# EAGLE design ReflowController_true_rev2 (EAGLE 6.5.0)
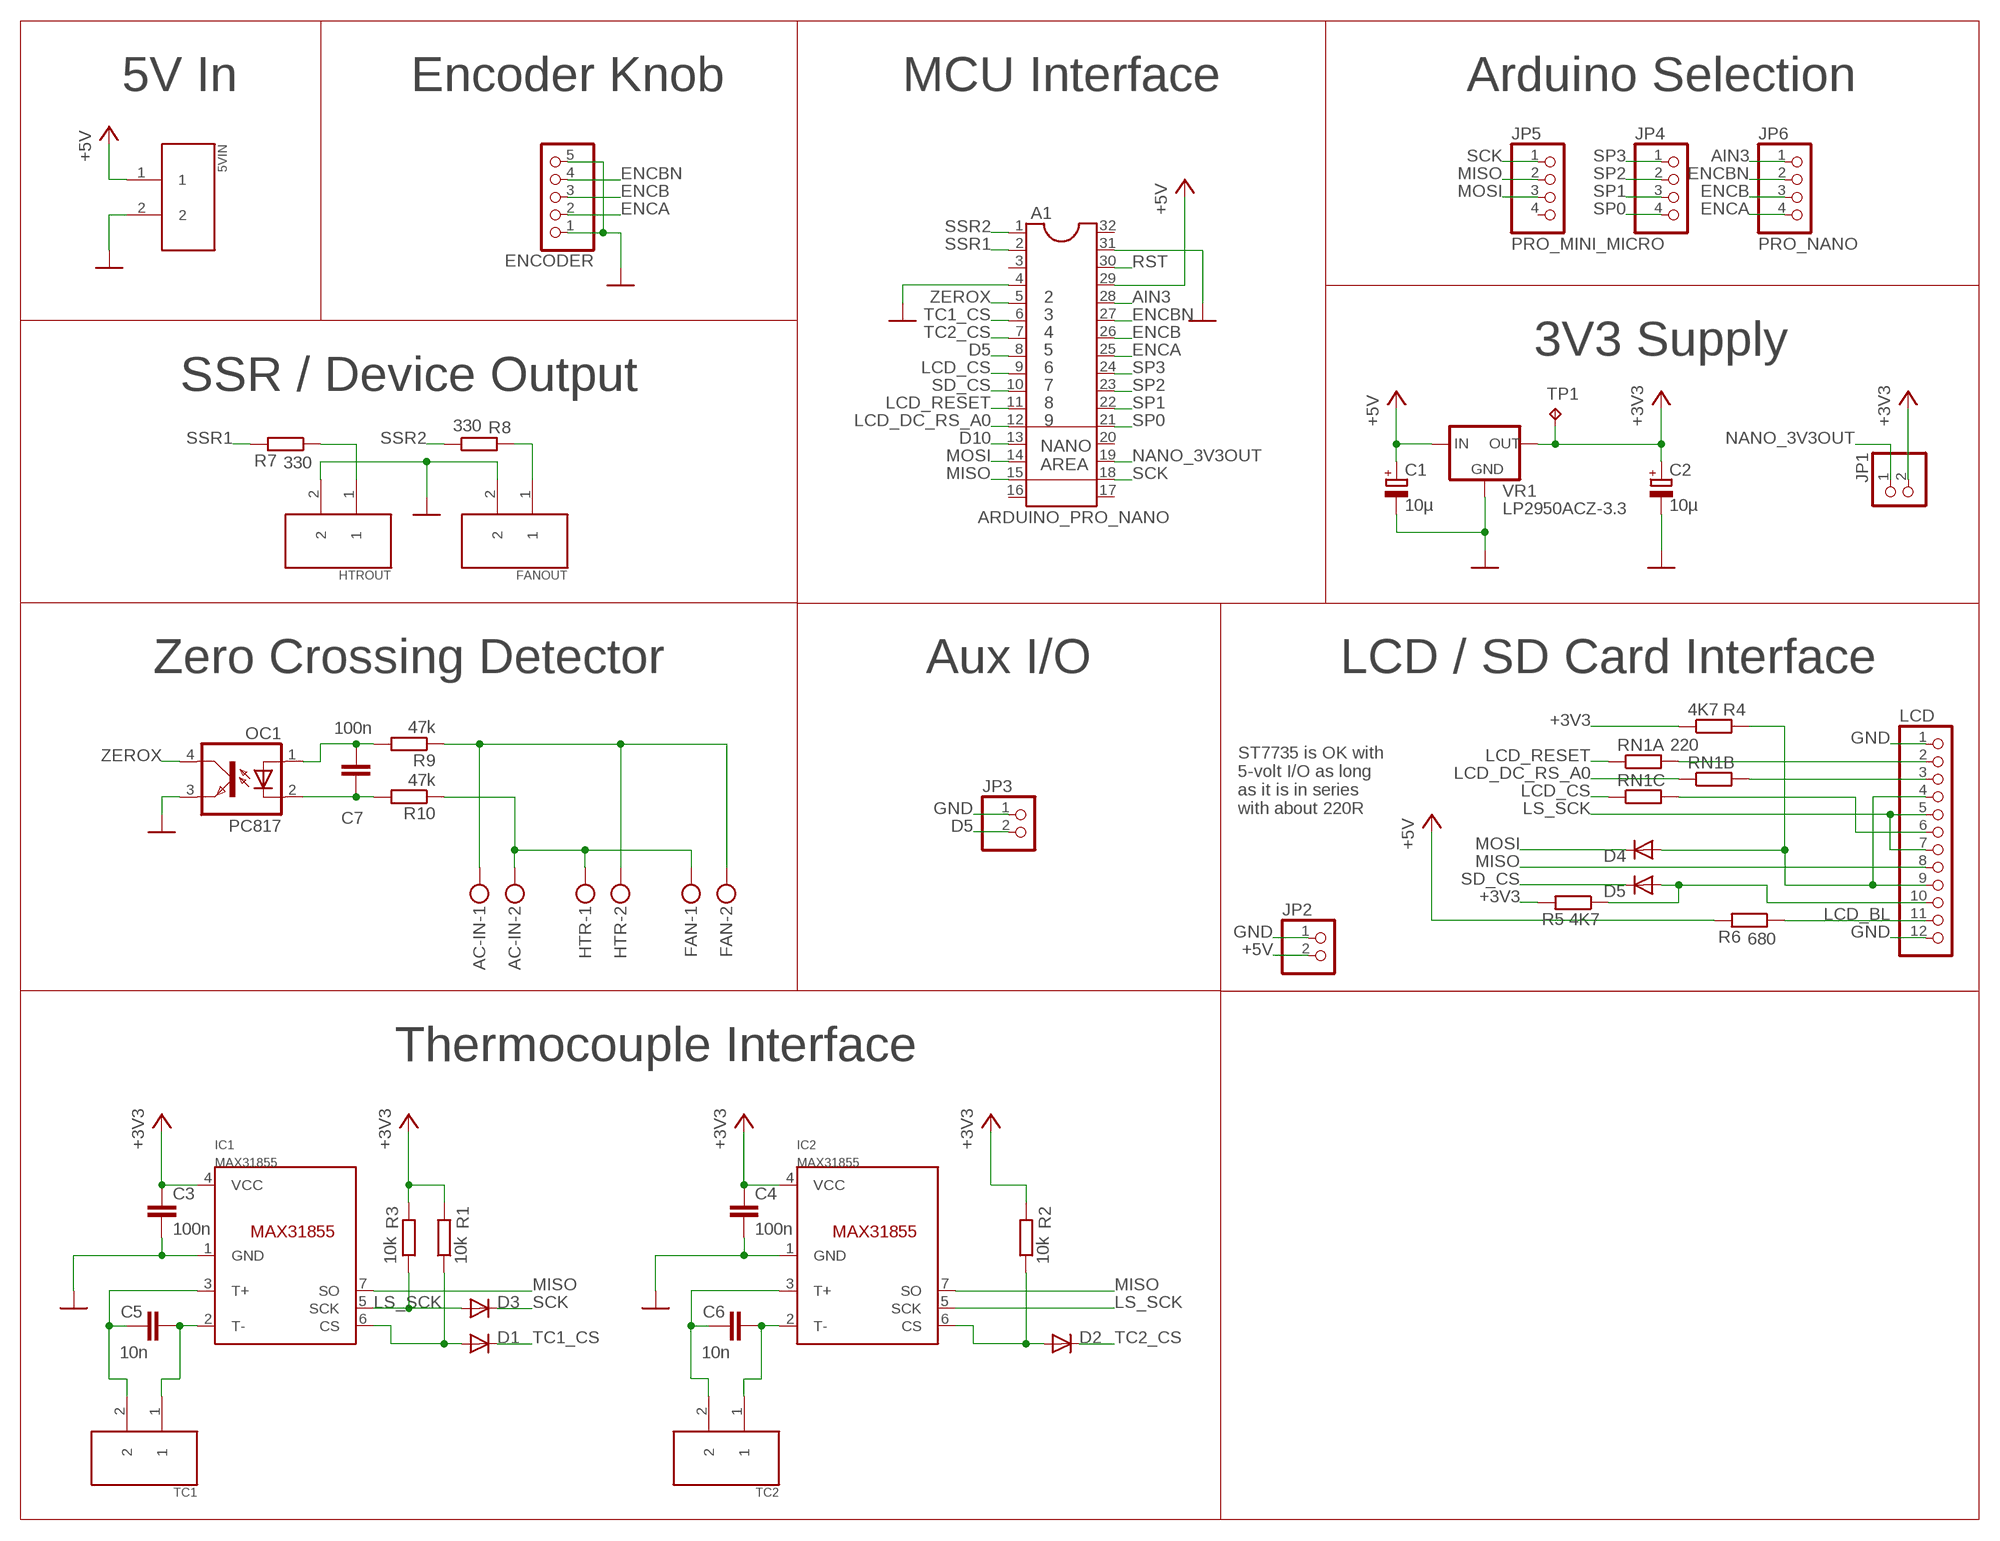
[diagram p0: schematic, sheet 1]

## Parts
5VIN  WECO_110-M-221/2  [WECO-PHOENIXTERM-2-POS]
A1  ARDUINO_PRO_NANO  DIL32  [DIL32]
AC-IN  MKDSN1,5/2-5,08  [MKDSN1,5/2-5,08]
C1  10µ  CPOL-EUC/6032-28R  [C/6032-28R]
C2  10µ  CPOL-EUC/6032-28R  [C/6032-28R]
C3  100n  C-EUC0805  [C0805]
C4  100n  C-EUC0805  [C0805]
C5  10n  C-EUC0805  [C0805]
C6  10n  C-EUC0805  [C0805]
C7  100n  C-EU150-054X183  [C150-054X183]
D1  DIODESOD-123  [SOD-123]
D2  DIODESOD-123  [SOD-123]
D3  DIODESOD-123  [SOD-123]
D4  DIODESOD-123  [SOD-123]
D5  DIODESOD-123  [SOD-123]
ENCODER  PINHD-1X5  [1X05]
FAN  MKDSN1,5/2-5,08  [MKDSN1,5/2-5,08]
FANOUT  WECO_110-M-221/2  [WECO-PHOENIXTERM-2-POS]
HTR  MKDSN1,5/2-5,08  [MKDSN1,5/2-5,08]
HTROUT  WECO_110-M-221/2  [WECO-PHOENIXTERM-2-POS]
IC1  MAX31855  [SOIC8]
IC2  MAX31855  [SOIC8]
JP1  PINHD-1X2  [1X02]
JP2  PINHD-1X2  [1X02]
JP3  PINHD-1X2  [1X02]
JP4  PINHD-1X4RND  [1X04_RND]
JP5  PRO_MINI_MICRO  PINHD-1X4RND  [1X04_RND]
JP6  PRO_NANO  PINHD-1X4RND  [1X04_RND]
LCD  PINHD-1X12  [1X12]
OC1  PC817  [DIL04]
R1  10k  R-EU_R0805  [R0805]
R2  10k  R-EU_R0805  [R0805]
R3  10k  R-EU_R0805  [R0805]
R4  4K7  R-EU_R0805  [R0805]
R5  4K7  R-EU_R0805  [R0805]
R6  680  R-EU_R0805  [R0805]
R7  330  R-EU_R0805  [R0805]
R8  330  R-EU_R0805  [R0805]
R9  47k  R-EU_0207/5V  [0207/5V]
R10  47k  R-EU_0207/5V  [0207/5V]
RN1  220  RESISTOR_ARRAY_4  [RN8P-4R-CRA06S]
TC1  WECO_110-M-221/2  [WECO-PHOENIXTERM-2-POS]
TC2  WECO_110-M-221/2  [WECO-PHOENIXTERM-2-POS]
TP1  TPTP08R  [TP08R]
VR1  LP2950ACZ-3.3  [TO92]

## Nets
+3V3: C2.+ C3.1 C4.1 IC1.4(VCC) IC2.4(VCC) JP1.2 R1.2 R2.2 R3.2 R4.1 R5.2 TP1.TP VR1.1(OUT)
+5V: 5VIN.1 A1.29 C1.+ JP2.2 R6.2 VR1.3(IN)
AC1: AC-IN.1 FAN.2 HTR.2 R9.1
AC2: AC-IN.2 FAN.1 HTR.1 R10.1
AIN3: A1.28 JP6.1
D5: A1.8 JP3.2
D10: A1.13
ENCA: A1.25 ENCODER.2 JP6.4
ENCB: A1.26 ENCODER.3 JP6.3
ENCBN: A1.27 ENCODER.4 JP6.2
GND: 5VIN.2 A1.4 A1.31 C1.- C2.- C3.2 C4.2 ENCODER.1 ENCODER.5 FANOUT.2 HTROUT.2 IC1.1(GND) IC2.1(GND) JP2.1 JP3.1 LCD.1 LCD.12 OC1.3(EMIT) VR1.2(GND)
LCD_BL: LCD.11 R6.1
LCD_CS: A1.9 RN1.3
LCD_DC_RS_A0: A1.12 RN1.2
LCD_RESET: A1.11 RN1.1
LS_MOSI: D4.A LCD.4 LCD.9 R4.2
LS_SCK: D3.A IC1.5(SCK) IC2.5(SCK) LCD.5 LCD.7 R3.1
LS_SD_CS: D5.A LCD.10 R5.1
MISO: A1.15 IC1.7(SO) IC2.7(SO) JP5.2 LCD.8
MOSI: A1.14 D4.C JP5.3
N$1: C5.2 IC1.2(T-) TC1.1
N$2: C6.2 IC2.2(T-) TC2.1
N$3: C6.1 IC2.3(T+) TC2.2
N$4: LCD.3 RN1.7
N$5: LCD.6 RN1.6
N$6: C7.2 OC1.1(A) R9.2
N$8: LCD.2 RN1.8
N$9: C7.1 OC1.2(C) R10.2
N$11: C5.1 IC1.3(T+) TC1.2
N$15: D2.A IC2.6(CS) R2.1
N$17: D1.A IC1.6(CS) R1.1
NANO_3V3OUT: A1.19 JP1.1
RST: A1.30
SCK: A1.18 D3.C JP5.1
SD_CS: A1.10 D5.C
SP0: A1.21 JP4.4
SP1: A1.22 JP4.3
SP2: A1.23 JP4.2
SP3: A1.24 JP4.1
SSR1: A1.2 R7.2
SSR1OUT: HTROUT.1 R7.1
SSR2: A1.1 R8.1
SSR2_OUT: FANOUT.1 R8.2
TC1_CS: A1.6 D1.C
TC2_CS: A1.7 D2.C
ZEROX: A1.5 OC1.4(COL)
Unconnected: A1.3 A1.16 A1.17 A1.20 A1.32 JP5.4 RN1.4 RN1.5

## Notes on the sheet
- 5V In | Encoder Knob | MCU Interface | Arduino Selection
- 2
- 3
- 4
- 5 | 3V3 Supply
- 6
- SSR / Device Output | 7
- 8
- 9
- NANO
  AREA
- Zero Crossing Detector | Aux I/O | LCD / SD Card Interface
- ST7735 is OK with
  5-volt I/O as long
  as it is in series
  with about 220R
- Thermocouple Interface

## Library data of the parts
5VIN FANOUT HTROUT TC1 TC2 = _trueControl:WECO_110-M-221/2
A1 = ic-package:DIL32: Dual In Line
AC-IN FAN HTR = con-phoenix-508:MKDSN1,5/2-5,08: MKDSN 1,5/ 2-5,08 Printklemme Nennstrom: 13,5 A Nennspannung: 250 V Rastermaß: 5,08 mm Polzahl: 2 Anschlussart: Schraubanschluss Montage: Löten Anschlussrichtung Leiter/Platine: 0 ° Artikelnummer: 1729128 Source: http://eshop.phoenixcontact.com .. 1729128.pdf; MPN: MKDSN 1,5/2-5.08; OC_FARNELL: 1792903; OC_NEWARK: 30M2397
C1 C2 = rcl:CPOL-EU: POLARIZED CAPACITOR, European symbol
C3-C7 = rcl:C-EU: CAPACITOR, European symbol
D1-D5 = adafruit:DIODE: Diode SMADIODE - SMA Surface Mount Package 20V 1A Schottky Diode Digikey: 641-1014-6-ND DO-1N4148 - Through Hole Small Current Diode SOD-123 20V 1 A (.5mV Vf) Schottky Diode - Digikey: MBRX120TPMSCT-ND SOD-323 10V 570mA (.38mV Vf, 3ns) Schottky Diode - Digikey: ZLLS410CT-ND SOD-523 30V 30mA Schottky Diode (RB751S-40TE61) - Digikey: RB751S-40TE61CT-ND SOT23-R/W - SOT23 Package (R = Solder Paste/Reflow Ovens, W = Hand-Soldering) BAT54Film 40V 300mA - Digikey: 497-7162-1-ND
ENCODER = pinhead:PINHD-1X5: PIN HEADER
IC1 IC2 = AlexW-Eagle-Libraries:MAX31855
JP1-JP3 = pinhead:PINHD-1X2: PIN HEADER
JP4-JP6 = pinhead:PINHD-1X4: PIN HEADER
LCD = pinhead:PINHD-1X12: PIN HEADER
OC1 = optocoupler:PC817: SHARP OPTO COUPLER; MPN: PC817X4J000F; OC_FARNELL: 9707727; OC_NEWARK: 97K7059
R1-R10 = rcl:R-EU_: RESISTOR, European symbol
RN1 = dp_devices:RESISTOR_ARRAY_4: 4 Resistor Array 0603
TP1 = testpad:TP: Test pad
VR1 = v-reg:LP2950?*: Source: http://cache.national.com/ds/LP/LP2950.pdf

## Board
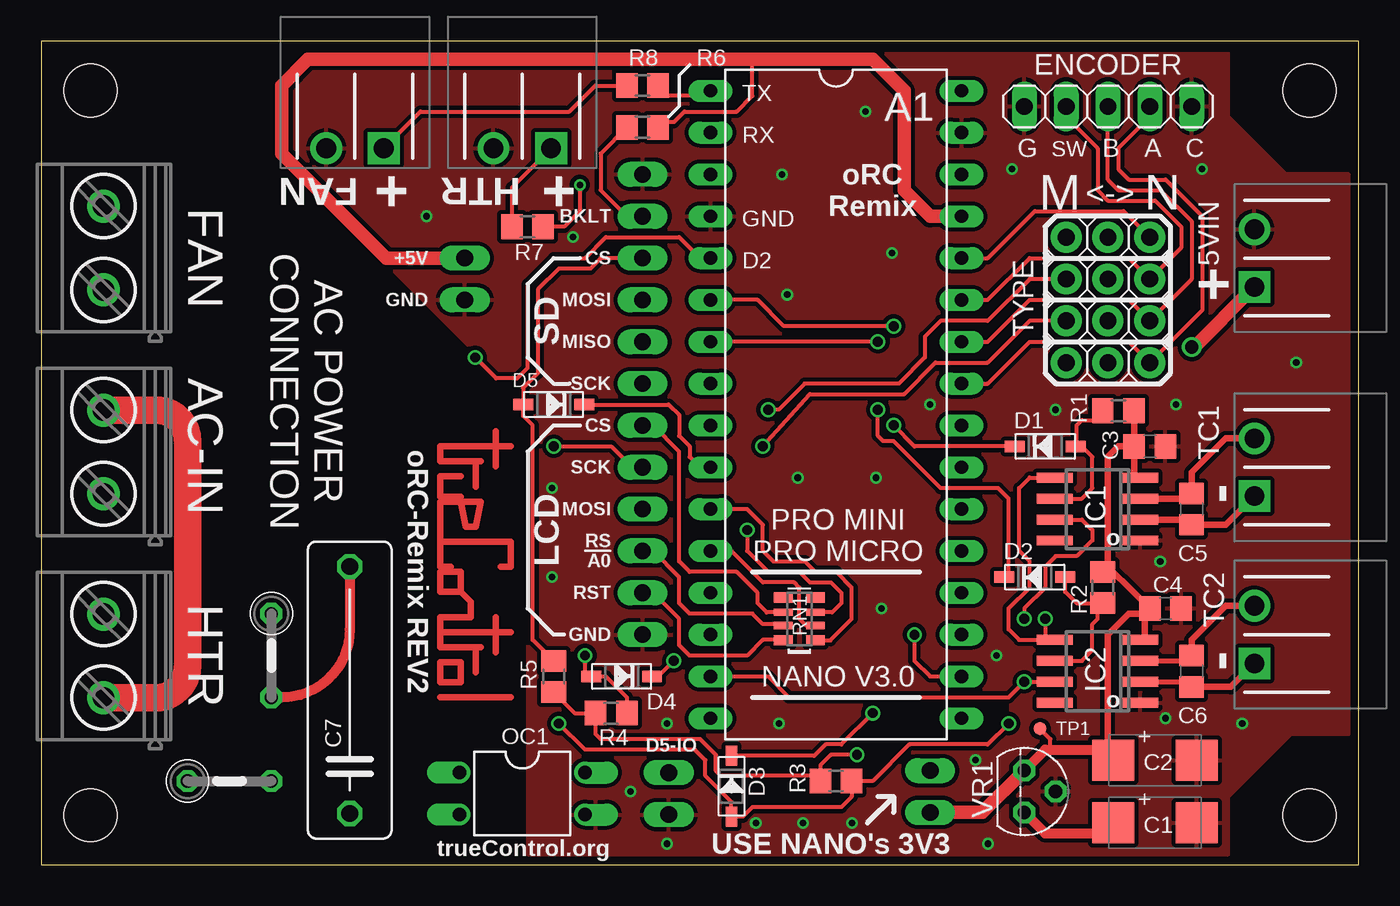
[diagram p1: board, top side]
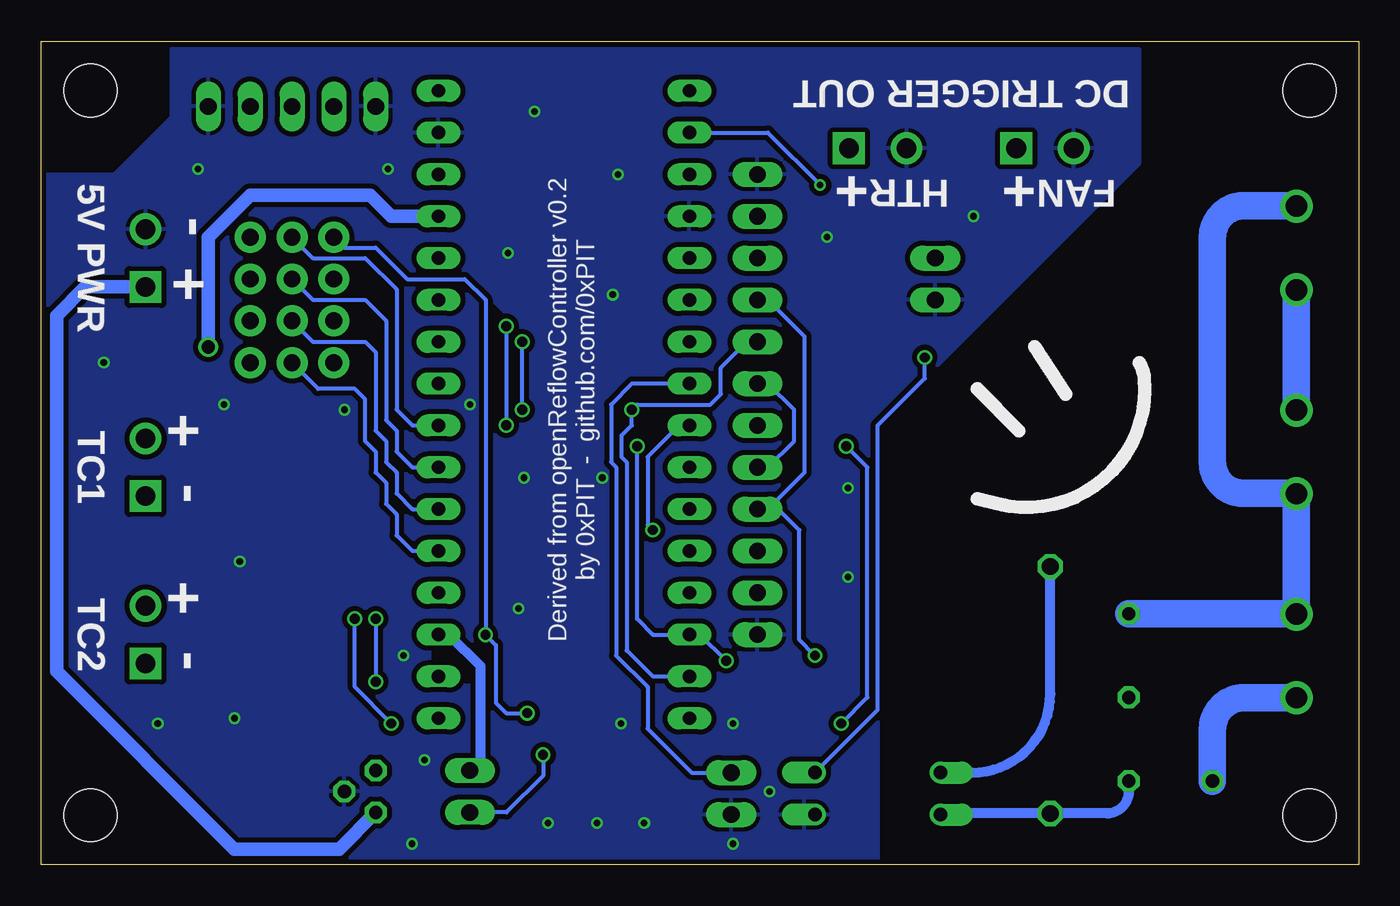
[diagram p2: board, bottom side, seen from below]

Size 80 x 50 mm. Coordinates in mm from the lower left corner, seen from the top.
Outline: 0,0 80,0 80,50 0,50 0,0
Copper layers (1*16): Top 0.035mm / dielectric 1.5mm / Bottom 0.035mm
Design rules "Elecrow_2LAYER *": minimum track width 6mil, minimum drill 12mil, track to track 8mil, track to pad 8mil, pad to pad 8mil, via to via 8mil, smd to smd 0mil, copper to edge 10mil, drill to drill 10mil, minimum pad ring 10mil, minimum via ring 6mil, stop-mask expansion 2mil, vias tented up to drill 100mil, thermal gap 10mil
Holes 3.2 mm at 3,3 77,3 3,47 77,47
tRestrict: 3 lines
bRestrict: 3 lines

### Footprints (pad centres in the part's own frame; a part is rotated, then mirrored left to right if it is on the bottom)
WECO-PHOENIXTERM-2-POS = drill 1.2 pad 1.93 square: 1 -1.75,1.27 | drill 1.2 pad 1.93: 2 1.75,1.27
DIL32 = drill 0.813 long: 1 -19.05,-7.62; 2 -16.51,-7.62; 3 -13.97,-7.62; 4 -11.43,-7.62; 5 -8.89,-7.62; 6 -6.35,-7.62; 7 -3.81,-7.62; 8 -1.27,-7.62; 9 1.27,-7.62; 10 3.81,-7.62; 11 6.35,-7.62; 12 8.89,-7.62; 13 11.43,-7.62; 14 13.97,-7.62; 15 16.51,-7.62; 16 19.05,-7.62; 17 19.05,7.62; 18 16.51,7.62; 19 13.97,7.62; 20 11.43,7.62; 21 8.89,7.62; 22 6.35,7.62; 23 3.81,7.62; 24 1.27,7.62; 25 -1.27,7.62; 26 -3.81,7.62; 27 -6.35,7.62; 28 -8.89,7.62; 29 -11.43,7.62; 30 -13.97,7.62; 31 -16.51,7.62; 32 -19.05,7.62
MKDSN1,5/2-5,08 = drill 1.3 pad 2: 1 -2.561,0.025; 2 2.519,0.025
C/6032-28R = smd 2.55 x 2.5: + 2.525,0; - -2.525,0
C0805 = smd 1.3 x 1.5: 1 -0.95,0; 2 0.95,0
C150-054X183 = drill 1.016 octagon: 1 -7.493,0; 2 7.493,0
SOD-123 = smd 1.2 x 0.7: A 1.85,0; C -1.85,0
1X05 = drill 1.016 long: 1 -5.08,0; 2 -2.54,0; 3 0,0; 4 2.54,0; 5 5.08,0
SOIC8 = smd 0.6 x 2.2: 1 -1.905,-2.6; 2 -0.635,-2.6; 3 0.635,-2.6; 4 1.905,-2.6; 5 1.905,2.6; 6 0.635,2.6; 7 -0.635,2.6; 8 -1.905,2.6
1X02 = drill 1.016 long: 1 -1.27,0; 2 1.27,0
1X04_RND = drill 1.016 pad 1.88: 1 -3.81,0; 2 -1.27,0; 3 1.27,0; 4 3.81,0
1X12 = drill 1.016 long: 1 -13.97,0; 2 -11.43,0; 3 -8.89,0; 4 -6.35,0; 5 -3.81,0; 6 -1.27,0; 7 1.27,0; 8 3.81,0; 9 6.35,0; 10 8.89,0; 11 11.43,0; 12 13.97,0
DIL04 = drill 0.813 offset: 1 -1.27,-3.81; 2 1.27,-3.81; 3 1.27,3.81; 4 -1.27,3.81
R0805 = smd 1.3 x 1.5: 1 -0.95,0; 2 0.95,0
0207/5V = drill 0.813 octagon: 1 -2.54,0; 2 2.54,0
RN8P-4R-CRA06S = smd 0.63 x 1.15: 1 -1.295,-0.975; 4 1.295,-0.975; 5 1.295,0.975; 8 -1.295,0.975 | smd 0.44 x 1.15: 2 -0.4,-0.975; 3 0.4,-0.975; 6 0.4,0.975; 7 -0.4,0.975
TP08R = smd 0.8 x 0.8: TP 0,0
TO92 = drill 0.813 octagon: 1 -1.27,0; 2 0,1.905; 3 1.27,0

### Placement (x,y rotation side)
5VIN  74.93,36.83 90 top
A1  48.26,27.94 270 top
AC-IN  3.81,25.08 90 top
C1  67.63,2.54 180 top
C2  67.63,6.35 180 top
C3  67.31,25.4 0 top
C4  68.26,15.56 0 top
C5  69.85,21.59 270 top
C6  69.85,11.75 270 top
C7  18.73,10.6 90 top
D1  60.96,25.4 0 top
D2  60.33,17.46 0 top
D3  41.91,4.76 270 top
D4  35.24,11.43 180 top
D5  31.11,27.94 180 top
ENCODER  64.77,46.04 180 top
FAN  3.81,37.47 90 top
FANOUT  19.05,44.77 180 top
HTR  3.81,12.7 90 top
HTROUT  29.21,44.77 180 top
IC1  64.14,21.59 90 top
IC2  64.14,11.75 90 top
JP1  53.98,4.45 270 top
JP2  25.72,35.56 90 top
JP3  38.1,4.32 90 top
JP4  64.77,34.29 270 top
JP5  62.23,34.29 270 top
JP6  67.31,34.29 270 top
LCD  36.51,27.94 90 top
OC1  29.21,4.32 270 top
R1  65.41,27.56 0 top
R2  64.45,16.83 90 top
R3  48.26,5.08 180 top
R4  34.61,9.21 0 top
R5  31.11,11.43 270 top
R6  36.51,44.77 0 top
R7  29.53,38.73 0 top
R8  36.51,47.31 180 top
R9  13.97,12.7 270 top
R10  11.43,5.08 0 top
RN1  46.04,14.92 90 top
TC1  74.93,24.13 90 top
TC2  74.93,13.97 90 top
TP1  60.64,8.26 0 top
U$1  [TC_LOGO]  24.45,25.4 270 top
VR1  59.69,4.45 270 top

### Tracks (layer width: path | path; a pad name or v marks a point on that pad's centre or on a via)
+3V3  (via drill 0.6)
  Top 0.254: 61.28,6.99 61.28,7.62 TP1.TP | v49.53,6.67 47.94,6.67 47.31,6.04 | 47.31,6.04 R3.2 | 47.31,6.04 47.31,6.03 47.31,5.4 41.27,5.4 40.96,5.71 40.96,6.67 40.01,7.62 33.97,7.62 33.66,7.93 R4.1 32.39,9.21 R5.2 | 64.77,6.68 C2.+
  Top 0.406: IC1.4 66.36,23.5 C3.1 | R1.2 C3.1 | 66.36,13.65 IC2.4 67,13.91 67,15.24 | 64.77,6.68 64.77,6.99 64.77,13.97 66.04,15.24 67,15.24 | 67,15.24 C4.1 66.36,16.51 | 64.77,18.1 64.77,24.77 65.41,25.4 C3.1 | 66.36,16.51 64.77,18.1 | 66.36,16.51 | 64.77,18.1 64.77,18.09 R2.2
  Top 0.61: 64.77,6.99 61.28,6.99 60.96,6.99 VR1.1
  Top 0.813: JP1.2 57.15,3.17 VR1.1
  Bottom 0.254: 53.02,3.17 JP1.2 51.75,3.17 49.53,5.4 v49.53,6.67
+5V  (via drill 0.8)
  Top 0.254: 43.18,48.9 43.18,46.67 42.23,45.72 39.05,45.72 38.42,45.09 37.78,45.09 R6.2
  Top 0.61: VR1.3 60.96,1.91 65.09,1.91 65.1,2.24 C1.+
  Top 0.813: 5VIN.1 69.85,31.27 v69.85,31.43 | A1.29 53.98,39.37 52.39,40.96 52.39,46.99 50.48,48.9 43.18,48.9 16.19,48.9 14.61,47.31 14.61,43.18 20.95,36.83 JP2.2
  Bottom 0.813: v69.85,31.43 69.85,38.1 67.31,40.64 60.01,40.64 58.74,39.37 A1.29 | VR1.3 61.91,0.95 68.26,0.95 79.06,11.75 79.06,33.34 77.31,35.08 5VIN.1
AC1
  Bottom 1.676: FAN.2 3.81,40.01 6.99,40.01 arc-90 8.89,38.1 8.89,24.45 arc-90 6.99,22.54 3.81,22.54 AC-IN.1 3.79,15.26 3.81,15.24 | HTR.2 3.81,15.24 | 3.81,15.24 R9.1
AC2
  Top 1.676: AC-IN.2 7.01,27.6 arc-90 8.89,25.72 8.89,12.06 arc-90 6.96,10.14 HTR.1
  Bottom 0.254: 3.81,27.62 AC-IN.2
  Bottom 1.676: 3.81,27.62 3.79,27.64 FAN.1 | R10.1 8.89,8.21 arc90 6.96,10.14 HTR.1
AIN3
  Top 0.254: A1.28 57.47,36.83 60.33,39.69 65.72,39.69 JP6.1
D5
  Bottom 0.254: A1.8 44.13,29.21 45.4,27.94 45.4,24.45 45.09,24.13 45.09,12.7 43.18,10.79 43.18,8.26 40.51,5.59 JP3.2
ENCA
  Top 0.254: A1.25 57.47,29.21 60.01,31.75 66.04,31.75 JP6.4 70.48,33.66 70.48,39.37 68.26,41.59 66.04,41.59 65.41,42.23 65.41,43.5 67.31,45.4 ENCODER.2
ENCB
  Top 0.254: A1.26 57.47,31.75 60.01,34.29 66.04,34.29 JP6.3 69.85,35.56 69.85,39.05 67.94,40.96 65.41,40.96 64.77,41.59 ENCODER.3
ENCBN
  Top 0.254: A1.27 57.47,34.29 60.01,36.83 66.04,36.83 JP6.2 69.22,37.47 69.22,38.73 67.63,40.32 64.77,40.32 64.14,40.96 64.14,43.5 62.23,45.4 ENCODER.4
GND  (via drill 0.4 pad 0.61)
  other vias: 68.26,8.89 43.39,2.54 49.23,2.54 46.25,2.54 67.94,18.41 68.9,27.94 70.48,42.23 76.2,30.48 44.78,8.57 37.99,8.57 23.39,39.37 58.95,42.23 44.98,41.91 35.77,4.45 32.28,38.1 31.01,22.86 31.01,17.46 45.93,23.5 51.65,37.15 51.01,15.56 61.59,27.62 50.7,23.5 72.92,8.57 58,12.7 56.73,6.35 37.99,1.27 53.98,27.94 45.3,34.61 50.06,45.72 57.48,1.27
  pour Bottom (isolate 0.305): 13.34,49.53 13.34,42.55 29.21,26.67 29.21,0.32 72.07,0.32 72.07,4.13 75.88,7.94 79.69,7.94 79.69,41.91 75.56,41.91 72.07,45.4 72.07,49.53
  pour Top (isolate 0.254): 14.29,49.21 14.29,43.18 29.53,27.94 29.53,0.64 72.07,0.64 72.07,4.13 75.88,7.94 79.38,7.94 79.38,41.91 75.56,41.91 72.07,45.4 72.07,49.21
LCD_BL
  Top 0.254: R6.1 33.97,43.18 33.97,40.96 35.56,39.37 LCD.11
LCD_CS  (via drill 0.6)
  Top 0.254: RN1.3 48.02,15.32 48.58,15.88 48.58,16.51 47.94,17.14 46.67,17.14 46.04,17.78 44.13,17.78 42.86,19.05 v42.86,20.32
  Bottom 0.254: A1.9 41.27,26.67 43.18,24.77 43.18,20.64 v42.86,20.32
LCD_DC_RS_A0
  Top 0.254: RN1.2 46.44,14.52 46.04,14.92 46.04,16.83 45.72,17.14 43.81,17.14 41.91,19.05 A1.12
LCD_RESET
  Top 0.254: RN1.1 47.92,13.63 49.21,14.92 49.21,16.83 48.26,17.78 46.99,17.78 46.35,18.41 44.45,18.41 43.81,19.05 43.81,20.64 42.86,21.59 A1.11
LS_MOSI  (via drill 0.6)
  Top 0.254: R4.2 35.56,10.16 34.29,11.43 D4.A 33.02,11.43 v33.02,12.7
  Bottom 0.254: LCD.9 35.88,34.29 33.66,32.07 33.66,23.81 35.88,21.59 LCD.4 35.24,21.59 33.97,20.32 33.97,13.65 v33.02,12.7
LS_SCK  (via drill 0.6)
  Top 0.254: v58.74,8.57 57.47,7.3 52.7,7.3 50.48,5.08 R3.1 49.21,4.13 48.58,3.49 43.18,3.49 42.6,2.91 D3.A | 60.96,13.65 59.37,13.65 58.74,14.29 58.74,15.56 60.01,16.83 60.01,18.41 59.37,19.05 59.37,22.86 60.01,23.5 IC1.5 | 60.96,13.65 IC2.5 | v60.96,14.92 60.96,13.65 | D3.A 41.91,3.81 40.32,5.4 40.32,6.35 39.69,6.99 33.02,6.99 v31.43,8.57 | v31.11,25.4 34.61,25.4 35.88,24.13 LCD.5 | 41.91,2.86 D3.A
  Top 0.406: 61.59,13.65 IC2.5
  Bottom 0.254: v58.74,8.57 60.96,10.79 v60.96,14.92 | LCD.5 35.88,24.13 34.29,25.72 34.29,27.62 35.88,29.21 LCD.7 | v31.43,8.57 29.84,10.16 29.84,24.13 v31.11,25.4
LS_SD_CS
  Top 0.254: R5.1 29.84,13.65 29.84,26.67 29.27,27.25 D5.A 29.27,28.95 30.16,29.84 30.16,34.92 31.43,36.2 33.34,36.2 33.97,36.83 LCD.10
MISO  (via drill 0.6)
  Top 0.254: JP5.2 60.01,35.56 57.47,33.02 54.61,33.02 53.66,32.07 53.66,30.8 52.07,29.21 46.35,29.21 44.77,27.62 v44.13,27.62 | IC2.7 v59.69,11.11 58.74,10.16 45.4,10.16 44.13,11.43 A1.15 | IC1.7 63.18,20.95 63.82,20.32 63.82,19.68 62.87,18.73 61.59,18.73 60.96,18.1 60.96,16.83 59.69,15.56 v59.69,14.92
  Bottom 0.254: A1.15 42.86,11.43 44.45,13.02 44.45,24.45 44.77,24.77 44.77,26.04 44.13,26.67 v44.13,27.62 43.81,27.94 39.37,27.94 38.73,28.57 38.73,30.16 37.15,31.75 LCD.8 | v59.69,14.92 v59.69,11.11
MOSI  (via drill 0.6)
  Top 0.254: JP5.3 60.01,33.02 57.47,30.48 54.29,30.48 52.39,28.57 46.67,28.57 v43.81,25.4 | D4.C 37.47,11.43 v38.42,12.38
  Bottom 0.254: v43.81,25.4 43.81,14.92 42.86,13.97 A1.14 40.01,13.97 v38.42,12.38
N$1
  Top 0.406: IC1.2 69.53,20.95 C5.2 71.92,20.64 TC1.1
N$2
  Top 0.305: IC2.2 69.53,11.11 C6.2
  Top 0.406: TC2.1 72.24,10.8 C6.2
N$3
  Top 0.305: IC2.3 69.53,12.38 C6.1
  Top 0.406: C6.1 69.85,13.65 71.92,15.72 TC2.2
N$4
  Top 0.254: RN1.7 44.98,14.61 43.81,14.61 43.18,15.24 39.37,15.24 38.73,15.88 38.73,17.46 37.15,19.05 LCD.3
N$5
  Top 0.254: RN1.6 44.05,15.32 43.5,15.88 43.5,16.51 42.23,17.78 39.37,17.78 38.73,18.41 38.73,25.08 37.15,26.67 LCD.6
N$6
  Top 0.61: R9.2 14.61,10.16 arc90 18.73,14.29 C7.2
  Bottom 0.61: OC1.1 23.5,5.59 arc-90 18.73,10.35 C7.2
N$8
  Top 0.254: LCD.2 37.15,16.51 38.73,14.92 38.73,13.34 39.37,12.7 42.86,12.7 43.81,13.65 45.04,13.65 RN1.8
N$9
  Bottom 0.61: OC1.2 arc90 25.34,3.11 C7.1 15.3,3.11 arc-90 13.97,4.45 R10.2
N$11
  Top 0.406: IC1.3 69.53,22.23 C5.1 69.85,23.81 71.92,25.88 TC1.2
N$15
  Top 0.254: IC2.6 63.18,12.38 63.82,13.02 63.82,14.61 64.14,14.92 64.14,15.56 R2.1 62.87,15.88 62.17,16.57 D2.A
N$17
  Top 0.254: IC1.6 63.18,22.23 63.82,22.86 63.82,24.77 63.18,25.4 | 63.18,25.4 D1.A | 63.18,25.4 62.87,25.72 62.87,26.67 63.18,26.99 64.14,26.99 64.45,27.31 R1.1
NANO_3V3OUT
  Bottom 0.61: A1.19 55.24,13.97 53.34,12.06 53.34,6.03 53.66,5.71 JP1.1
SCK  (via drill 0.6)
  Top 0.254: v53.02,13.97 53.02,12.38 53.98,11.43 A1.18 55.56,11.43 | v50.48,9.21 48.58,7.3 47.62,7.3 46.94,6.61 D3.C
  Bottom 0.254: JP5.1 61.59,37.47 59.69,37.47 57.78,35.56 54.29,35.56 53.02,34.29 v53.02,13.97 52.39,13.34 52.39,9.84 51.75,9.21 v50.48,9.21
SD_CS
  Top 0.254: D5.C 38.1,27.94 38.73,27.3 38.73,26.04 39.37,25.4 39.37,24.77 40.01,24.13 A1.10
SP0
  Bottom 0.254: A1.21 57.47,19.05 58.42,20 58.42,21.27 59.05,21.91 59.05,23.18 59.69,23.81 59.69,25.08 60.33,25.72 60.33,28.26 60.96,28.89 63.18,28.89 JP4.4
SP1
  Bottom 0.254: JP4.3 63.5,31.75 60.33,31.75 59.69,31.11 59.69,26.35 59.05,25.72 59.05,24.45 58.42,23.81 58.42,22.54 57.47,21.59 A1.22
SP2
  Bottom 0.254: JP4.2 63.5,34.29 60.33,34.29 59.05,33.02 59.05,26.99 58.42,26.35 58.42,25.08 57.47,24.13 A1.23
SP3
  Bottom 0.254: JP4.1 63.5,36.83 60.33,36.83 58.42,34.92 58.42,27.62 57.47,26.67 A1.24
SSR1  (via drill 0.4)
  Top 0.254: v32.7,41.27 32.7,39.69 31.75,38.73 R7.2
  Bottom 0.254: A1.2 35.88,44.45 v32.7,41.27
SSR1OUT
  Top 0.254: 28.89,39.05 R7.1 | R7.1 28.57,39.05 | HTROUT.1 28.58,41.12 R7.1
SSR2
  Top 0.254: A1.1 40.32,46.67 38.1,46.67 R8.1 37.46,46.99
SSR2_OUT
  Top 0.254: 35.24,47.62 R8.2 33.66,47.31 32.07,45.72 23.02,45.72 FANOUT.1
TC1_CS  (via drill 0.6)
  Top 0.254: D1.C 53.02,25.4 v51.75,26.67 | v51.75,32.7 45.09,32.7 43.5,34.29 A1.6
  Bottom 0.254: v51.75,32.7 v51.75,26.67
TC2_CS  (via drill 0.6)
  Top 0.254: D2.C 58.74,17.52 58.74,22.23 58.1,22.86 54.61,22.86 51.75,25.72 51.12,25.72 50.8,26.04 v50.8,27.62 | v50.8,31.75 A1.7
  Bottom 0.254: v50.8,27.62 v50.8,31.75
ZEROX  (via drill 0.6)
  Top 0.254: A1.5 40.01,36.83 38.73,38.1 34.29,38.1 33.02,36.83 31.11,36.83 29.53,35.24 29.53,30.16 28.89,29.53 27.62,29.53 v26.35,30.8
  Bottom 0.254: OC1.4 29.21,9.4 29.21,26.67 26.35,29.53 v26.35,30.8

### Text on the board
tPlace: TX | RX | G | SW | B | A | C | FAN | + | HTR | + | M | <-> | N | BKLT | GND | oRC / Remix | +5V | CS | D2 | + | GND | MOSI | TYPE | SD | MISO | AC POWER / CONNECTION | SCK | CS | SCK | - | MOSI | LCD | PRO MINI | RS / A0 | o | oRC-Remix REV2 | PRO MICRO | RST | GND | - | NANO V3.0 | o | D5-IO | + | + | trueControl.org | USE NANO's 3V3
bPlace: DC TRIGGER OUT | FAN | + | HTR | + | - | 5V PWR | + | Derived from openReflowController v0.2 / by 0xPIT - github.com/0xPIT | + | TC1 | - | + | TC2 | -